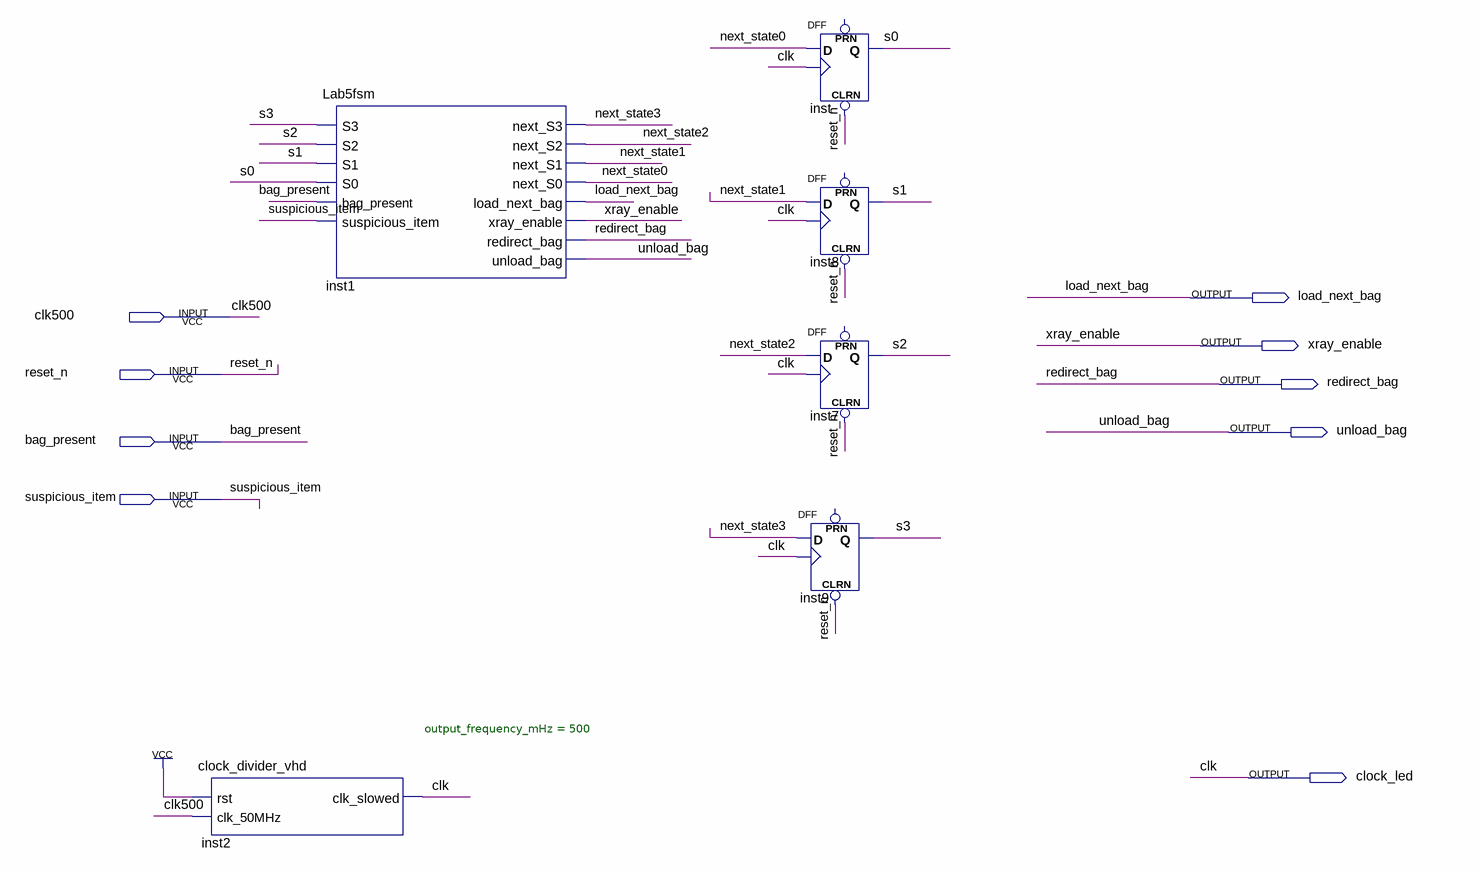
[diagram p0: schematic sheet]
// Quartus schematic lab5asm.bdf as structural Verilog: 6 symbols, 9 pins
module lab5asm (
  input  clk500,
  input  reset_n,
  input  bag_present,
  input  suspicious_item,
  output load_next_bag,
  output xray_enable,
  output redirect_bag,
  output unload_bag,
  output clock_led
);

  wire next_state0, next_state1, next_state2, next_state3, s0, s1, s2, s3;

  clock_divider_vhd #(.output_frequency_mHz(500)) inst2 (.rst(1'b1), .clk_50MHz(clk500), .clk_slowed(clock_led));
  Lab5fsm inst1 (
    .S3(s3), .S2(s2), .S1(s1), .S0(s0), .bag_present(bag_present), .suspicious_item(suspicious_item),
    .next_S3(next_state3), .next_S2(next_state2), .next_S1(next_state1), .next_S0(next_state0),
    .load_next_bag(load_next_bag), .xray_enable(xray_enable), .redirect_bag(redirect_bag),
    .unload_bag(unload_bag));
  DFF inst9 (.CLRN(reset_n), .CLK(clock_led), .D(next_state3), .Q(s3));  // open: PRN
  DFF inst (.CLRN(reset_n), .CLK(clock_led), .D(next_state0), .Q(s0));  // open: PRN
  DFF inst8 (.CLRN(reset_n), .CLK(clock_led), .D(next_state1), .Q(s1));  // open: PRN
  DFF inst7 (.CLRN(reset_n), .CLK(clock_led), .D(next_state2), .Q(s2));  // open: PRN

  // Other names for the same wires on the sheet: clk = clock_led
endmodule
